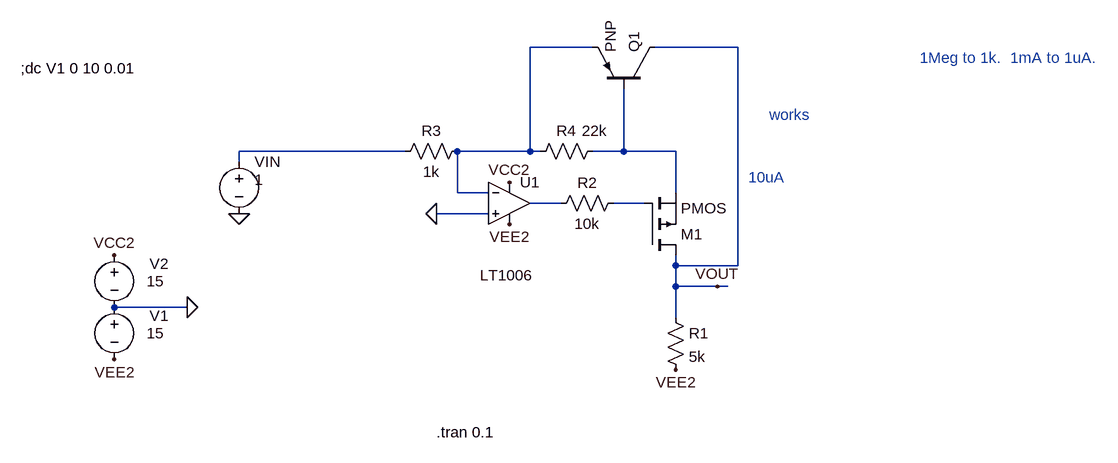
[diagram p0: schematic Draft12.asc]
Draft12.asc, the LTspice schematic file:
Version 4
SHEET 1 1536 680
WIRE 544 -144 448 -144
WIRE 768 -144 640 -144
WIRE 256 16 0 16
WIRE 448 16 448 -144
WIRE 448 16 336 16
WIRE 464 16 448 16
WIRE 592 16 592 -80
WIRE 592 16 544 16
WIRE 672 16 592 16
WIRE 0 32 0 16
WIRE 336 80 336 16
WIRE 384 80 336 80
WIRE 672 80 672 16
WIRE 496 96 448 96
WIRE 624 96 576 96
WIRE 384 112 304 112
WIRE 672 192 672 176
WIRE 768 192 768 -144
WIRE 768 192 672 192
WIRE 672 224 672 192
WIRE 736 224 672 224
WIRE 752 224 736 224
WIRE -80 256 -192 256
WIRE 672 272 672 224
FLAG -80 256 0
FLAG -192 336 VEE2
FLAG -192 176 VCC2
FLAG 416 128 VEE2
FLAG 416 64 VCC2
FLAG 736 224 VOUT
FLAG 0 112 0
FLAG 304 112 0
FLAG 672 352 VEE2
SYMBOL voltage 0 16 R0
WINDOW 123 0 0 Left 0
WINDOW 39 0 0 Left 0
WINDOW 3 24 44 Left 2
SYMATTR Value 1
SYMATTR InstName VIN
SYMBOL voltage -192 240 R0
WINDOW 0 54 29 Left 2
WINDOW 3 50 56 Left 2
WINDOW 123 0 0 Left 0
WINDOW 39 0 0 Left 0
SYMATTR InstName V1
SYMATTR Value 15
SYMBOL res 656 256 R0
SYMATTR InstName R1
SYMATTR Value 5k
SYMBOL OpAmps\\LT1006 416 32 R0
WINDOW 3 -45 175 Left 2
SYMATTR InstName U1
SYMBOL res 352 0 R90
WINDOW 0 0 56 VBottom 2
WINDOW 3 32 56 VTop 2
SYMATTR InstName R3
SYMATTR Value 1k
SYMBOL pmos 624 176 M180
SYMATTR InstName M1
SYMBOL voltage -192 160 R0
WINDOW 0 54 29 Left 2
WINDOW 3 50 56 Left 2
WINDOW 123 0 0 Left 0
WINDOW 39 0 0 Left 0
SYMATTR InstName V2
SYMATTR Value 15
SYMBOL res 592 80 R90
WINDOW 0 0 56 VBottom 2
WINDOW 3 32 56 VTop 2
SYMATTR InstName R2
SYMATTR Value 10k
SYMBOL res 560 0 R90
WINDOW 0 0 56 VBottom 2
WINDOW 3 -31 13 VTop 2
SYMATTR InstName R4
SYMATTR Value 22k
SYMBOL pnp 640 -80 M270
SYMATTR InstName Q1
TEXT -336 -112 Left 2 !;dc V1 0 10 0.01
TEXT 304 448 Left 2 !.tran 0.1
TEXT 816 -40 Left 2 ;works
TEXT 784 56 Left 2 ;10uA
TEXT 1048 -128 Left 2 ;1Meg to 1k.  1mA to 1uA.

The netlist it stands for:
* Draft12.asc
VIN N002 0 1
V1 0 VEE2 15
R1 VOUT VEE2 5k
XU1 0 N001 VCC2 VEE2 N004 LT1006  ; pins In+ In- V+ V- OUT
R3 N001 N002 1k
M1 VOUT N005 N003 N003 PMOS
V2 VCC2 0 15
R2 N005 N004 10k
R4 N003 N001 22k
Q1 VOUT N003 N001 0 PNP
.model NPN NPN
.model PNP PNP
.lib standard.bjt
.model NMOS NMOS
.model PMOS PMOS
.lib standard.mos
;dc V1 0 10 0.01
.tran 0.1
* works
* 10uA
* 1Meg to 1k.  1mA to 1uA.
.lib LTC.lib
.backanno
.end